# Altium project Debug Board.PrjPcb
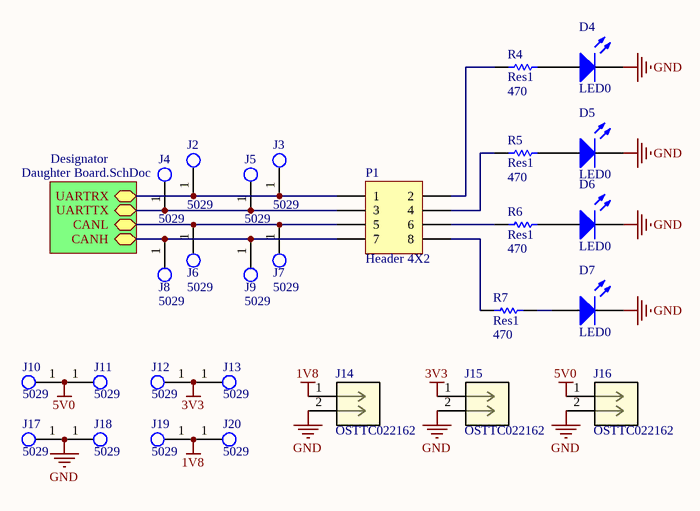
[diagram p0: Debug Board.SchDoc]
2 sheets, 35 parts. Net scope: hierarchical (ports join the sheet entries above them; power ports are global).
Board file: Debug Board.PcbDoc
Sheets:
  Debug Board.SchDoc
    Designator = Daughter Board.SchDoc

## Sheet Debug Board.SchDoc
size E

### Parts
D4  LED0  [1608[0603]]
D5  LED0  [1608[0603]]
D6  LED0  [1608[0603]]
D7  LED0  [1608[0603]]
J2  5029  [5029]
J3  5029  [Exposed Pad]
J4  5029  [5029]
J5  5029  [Exposed Pad]
J6  5029  [5029]
J7  5029  [Exposed Pad]
J8  5029  [5029]
J9  5029  [Exposed Pad]
J10  5029  [Exposed Pad]
J11  5029  [5029]
J12  5029  [Exposed Pad]
J13  5029  [5029]
J14  OSTTC022162  [CONN_OSTTC022162_OST]
J15  OSTTC022162  [CONN_OSTTC022162_OST]
J16  OSTTC022162  [CONN_OSTTC022162_OST]
J17  5029  [Exposed Pad]
J18  5029  [5029]
J19  5029  [Exposed Pad]
J20  5029  [5029]
P1  Header 4X2  [HDR2X4]
R4  Res1  value 470  [1608[0603]]
R5  Res1  value 470  [1608[0603]]
R6  Res1  value 470  [1608[0603]]
R7  Res1  value 470  [1608[0603]]

### Sub-sheets
Designator = Daughter Board.SchDoc: CANH (bidir), CANL (bidir), UARTTX (bidir), UARTRX (bidir)

### Nets
1V8: J14.1 J19.1 J20.1
3V3: J12.1 J13.1 J15.1
5V0: J10.1 J11.1 J16.1
GND: D4.2(K) D5.2(K) D6.2(K) D7.2(K) J14.2 J15.2 J16.2 J17.1 J18.1
NetD4_1: D4.1(A) R4.1
NetD5_1: D5.1(A) R5.1
NetD6_1: D6.1(A) R6.1
NetD7_1: D7.1(A) R7.1
NetJ1_18: J2.1 J3.1 P1.1 ; sheet Designator/UARTRX
NetJ1_19: J4.1 J5.1 P1.3 ; sheet Designator/UARTTX
NetJ1_20: J6.1 J7.1 P1.5 ; sheet Designator/CANL
NetJ1_21: J8.1 J9.1 P1.7 ; sheet Designator/CANH
NetP1_2: P1.2 R4.2
NetP1_4: P1.4 R5.2
NetP1_6: P1.6 R6.2
NetP1_8: P1.8 R7.2

### Library data of the parts
J14-J16 = OSTTC022162: No Description Available; Vendor: On Shore Technology Inc; Built_By: EMA_Cory; SourceLibrary: On_Shore_Technology_2019-12-02; Manufacturer_Part_Number: OSTTC022162; Copyright: Copyright (C) 2018 Accelerated Designs. All rights reserved; RefDes: RefDes; Type: DEV
P1 = Header 4X2: Header, 4-Pin, Dual row; LatestRevisionDate: 17-Jul-2002; LatestRevisionNote: Re-released for DXP Platform.; Publisher: Altium Limited
R4-R7 = Res1: Resistor; Published: 8-Jun-2000; LatestRevisionDate: 17-Jul-2002; LatestRevisionNote: Re-released for DXP Platform.; PackageReference: AXIAL-0.3; Publisher: Altium Limited; PackageDescription: Axial Device, Thru-Hole; 2 Leads; 0.3 in Pin Spacing
D4-D7 = LED0: Published: 8-Jun-2000; LatestRevisionDate: 08-Jul-2005; LatestRevisionNote: Mech Layer 1 removed.; PackageReference: LED-0; Publisher: Altium Limited; PackageDescription: LED; 2 Leads

## Sheet Daughter Board.SchDoc
size A
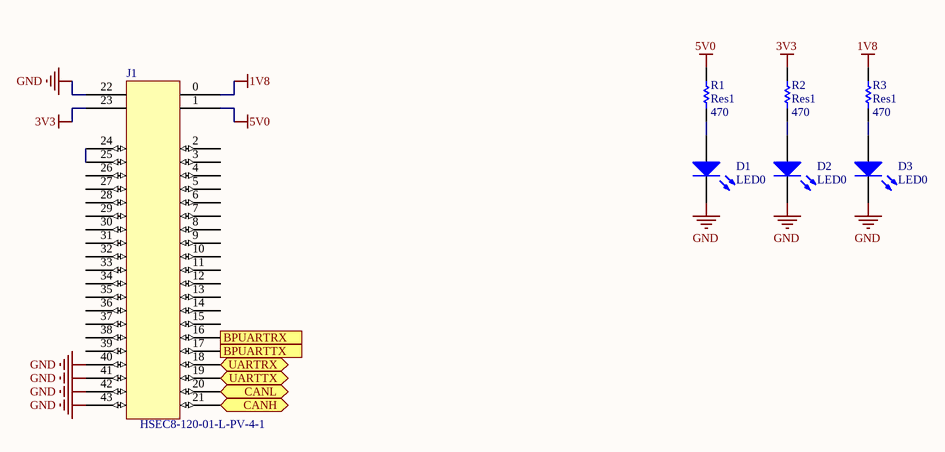
[diagram p1: Daughter Board.SchDoc]

### Parts
D1  LED0  [1608[0603]]
D2  LED0  [1608[0603]]
D3  LED0  [1608[0603]]
J1  HSEC8-120-01-L-PV-4-1  [HSEC8-120-01-L-PV-4-1 Gold Fingers]
R1  Res1  value 470  [1608[0603]]
R2  Res1  value 470  [1608[0603]]
R3  Res1  value 470  [1608[0603]]

### Ports
BPUARTRX (out), BPUARTTX (in), CANH (bidir), CANL (bidir), UARTRX (bidir), UARTTX (bidir)

### Nets
1V8: J1.0 R3.2
3V3: J1.23 R2.2
5V0: J1.1 R1.2
GND: D1.2(K) D2.2(K) D3.2(K) J1.22 J1.40 J1.41 J1.42 J1.43
NetD1_1: D1.1(A) R1.1
NetD2_1: D2.1(A) R2.1
NetD3_1: D3.1(A) R3.1
NetJ1_16: J1.16 ; port BPUARTRX
NetJ1_17: J1.17 ; port BPUARTTX
NetJ1_18: J1.18 ; port UARTRX
NetJ1_19: J1.19 ; port UARTTX
NetJ1_20: J1.20 ; port CANL
NetJ1_21: J1.21 ; port CANH
NetJ1_24: J1.24 J1.25

Not connected (* = marked no-connect by the designer): J1 2(0) 3(0) 4(0) 5(0) 6(0) 7(0) 8(0) 9(0) 10(0) 11(0) 12(0) 13(0) 14(0) 15(0) 26 27 28 29 30 31 32 33 34 35 36 37 38 39

### Library data of the parts
R1-R3 = Res1: Resistor; Published: 8-Jun-2000; LatestRevisionDate: 17-Jul-2002; LatestRevisionNote: Re-released for DXP Platform.; PackageReference: AXIAL-0.3; Publisher: Altium Limited; PackageDescription: Axial Device, Thru-Hole; 2 Leads; 0.3 in Pin Spacing
D1-D3 = LED0: Published: 8-Jun-2000; LatestRevisionDate: 08-Jul-2005; LatestRevisionNote: Mech Layer 1 removed.; PackageReference: LED-0; Publisher: Altium Limited; PackageDescription: LED; 2 Leads
J1 = HSEC8-120-01-L-PV-4-1: Supplier 1: Mouser

## Nets that join several sheets
1V8: Debug Board (J14.1 J19.1 J20.1), Daughter Board (J1.0 R3.2)
3V3: Debug Board (J12.1 J13.1 J15.1), Daughter Board (J1.23 R2.2)
5V0: Debug Board (J10.1 J11.1 J16.1), Daughter Board (J1.1 R1.2)
GND: Debug Board (9 pins), Daughter Board (8 pins)
NetJ1_18: Debug Board (J2.1 J3.1 P1.1), Daughter Board (J1.18)
NetJ1_19: Debug Board (J4.1 J5.1 P1.3), Daughter Board (J1.19)
NetJ1_20: Debug Board (J6.1 J7.1 P1.5), Daughter Board (J1.20)
NetJ1_21: Debug Board (J8.1 J9.1 P1.7), Daughter Board (J1.21)